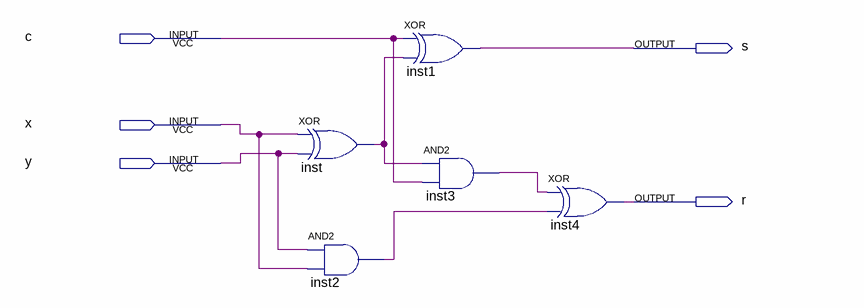
[diagram p0: schematic sheet]
// Quartus schematic add.bdf as structural Verilog: 5 symbols, 5 pins
module add (
  input  c,
  input  x,
  input  y,
  output s,
  output r
);

  wire inst2_out, inst3_out, inst_out;

  xor inst (inst_out, x, y);
  and inst2 (inst2_out, y, x);
  xor inst1 (s, c, inst_out);
  and inst3 (inst3_out, inst_out, c);
  xor inst4 (r, inst3_out, inst2_out);
endmodule
